# EAGLE design RM1xx-Breakout (EAGLE 7.7.0)
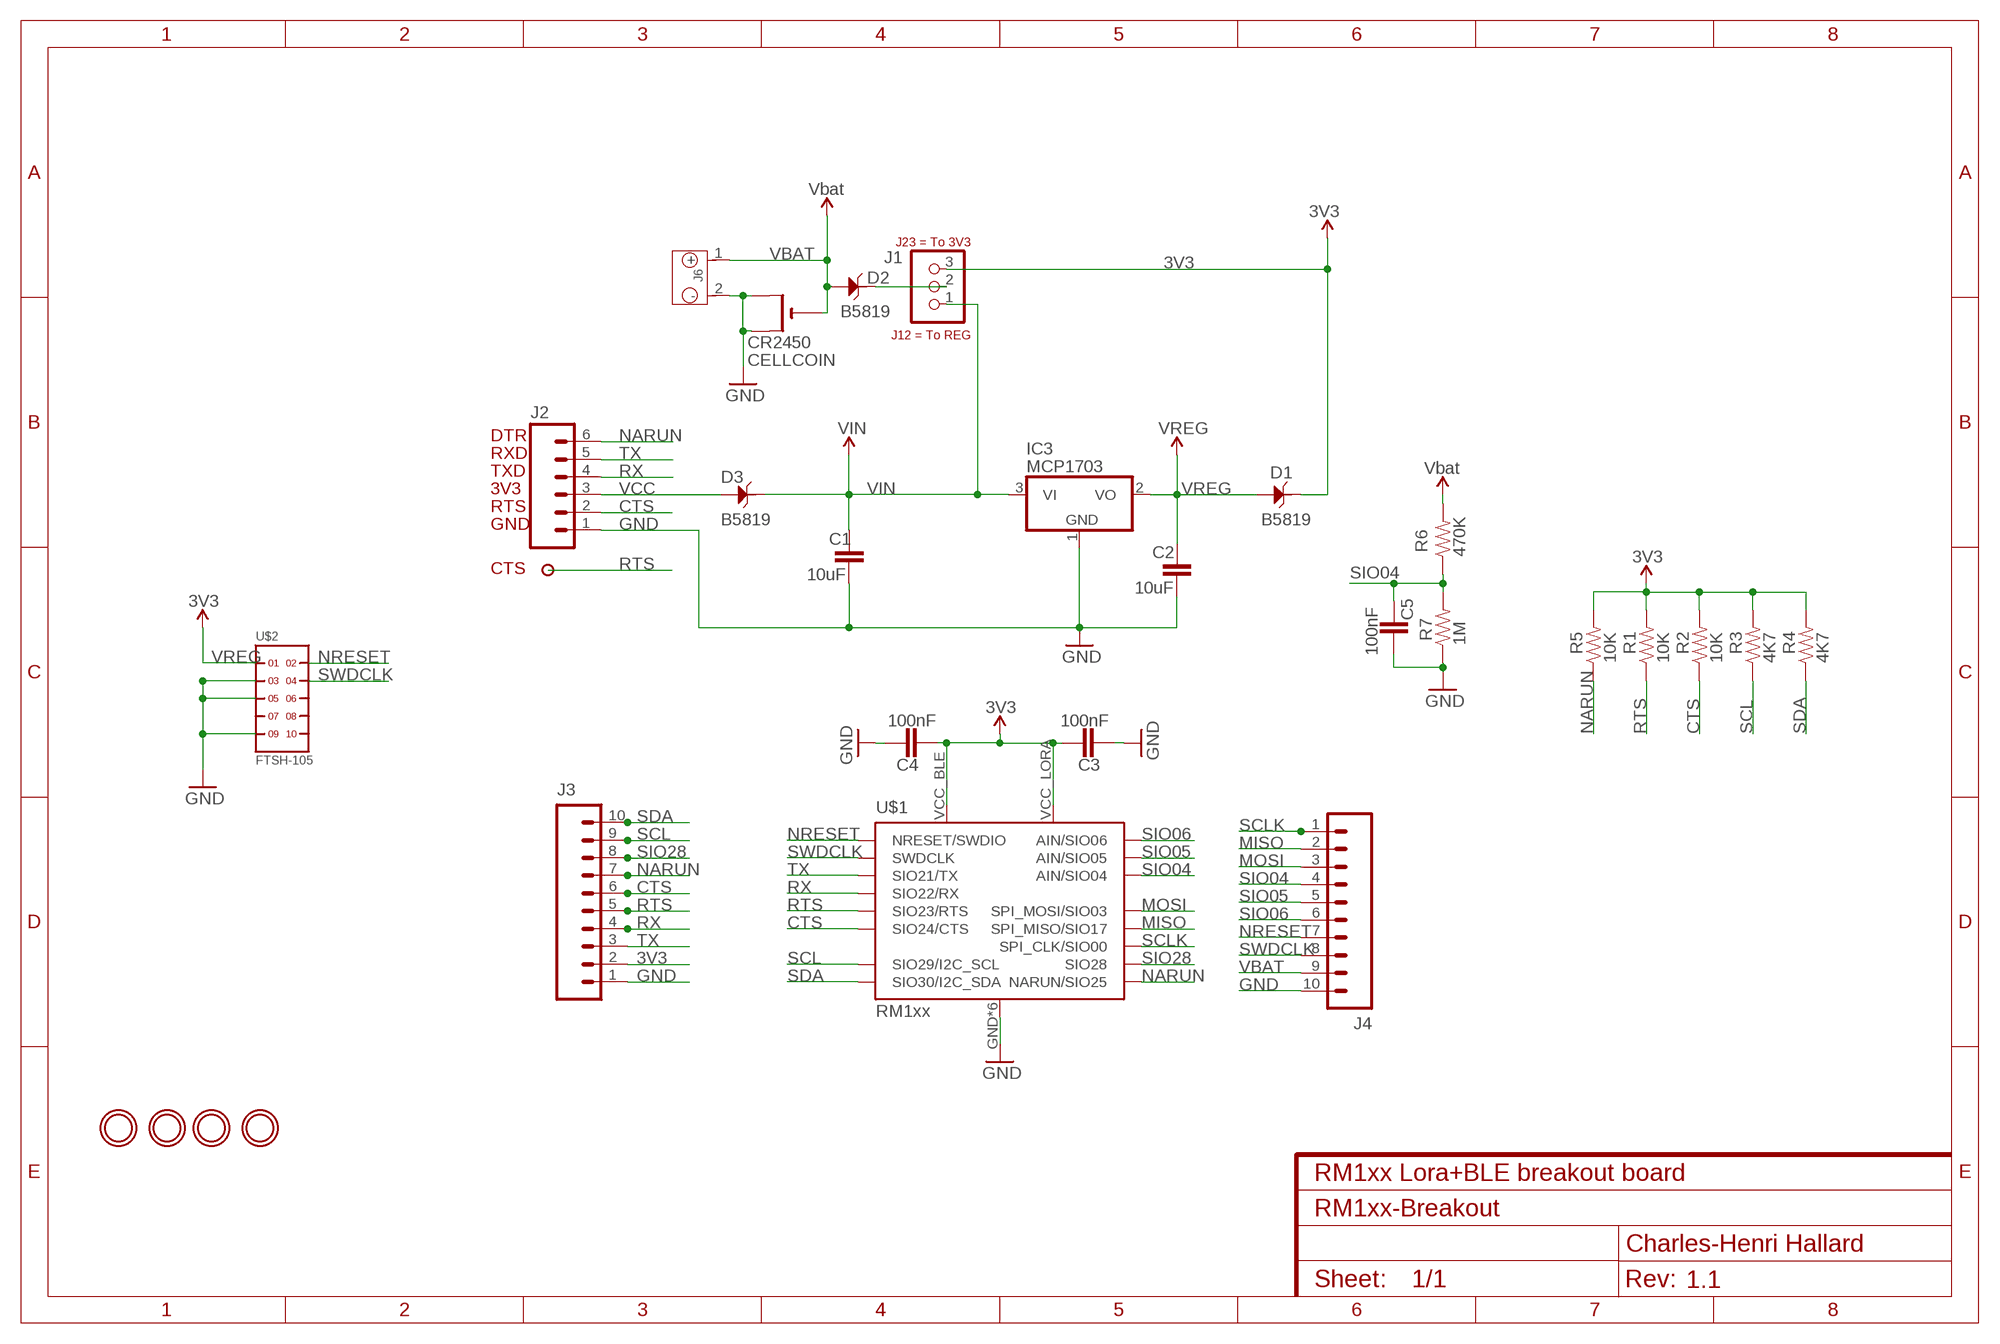
[diagram p0: schematic, sheet 1]
NAME (FRAME-A4L): CNAME: RM1xx Lora+BLE breakout board; CREVISION: 1.1; DESIGNER: Charles-Henri Hallard

## Parts
C1  10uF  CAP0805-CAP  [0805-CAP]
C2  10uF  CAP0805-CAP  [0805-CAP]
C3  100nF  CAP0805-CAP  [0805-CAP]
C4  100nF  CAP0805-CAP  [0805-CAP]
C5  100nF  CAP0805-CAP  [0805-CAP]
CELLCOIN  CR2450  CR2450SMD  [CR2450-SMD]
D1  B5819  D-ESD-2P-CESD5V0D1  [SOD123-2.7X1.6]
D2  B5819  D-ESD-2P-CESD5V0D1  [SOD123-2.7X1.6]
D3  B5819  D-ESD-2P-CESD5V0D1  [SOD123-2.7X1.6]
IC3  MCP1703  MCP1703CB  [SOT23]
J1  JUMPER_1X30805  [JP3_0805]
J2  M06SIP_LOCK  [1X06-SIP_LOCK]
J3  M10LOCK  [1X10_LOCK]
J4  M10LOCK  [1X10_LOCK]
J6  Lipo Battery  JST-2P-PW-3410070P1  [2P-2.0-90D]
P1  PADNORMAL  [PAD]
R1  10K  RESISTOR0805-RES  [0805-RES]
R2  10K  RESISTOR0805-RES  [0805-RES]
R3  4K7  RESISTOR0805-RES  [0805-RES]
R4  4K7  RESISTOR0805-RES  [0805-RES]
R5  10K  RESISTOR0805-RES  [0805-RES]
R6  470K  RESISTOR0805-RES  [0805-RES]
R7  1M  RESISTOR0805-RES  [0805-RES]
U$1  RM1xx  RM1XXSMD  [RM1XX]
U$2  FTSH-105  FTSH-105-01-XXX-DV-K  [FTSH-105-01-XXX-DV-K]
U$3  MOUNTINGHOLE2.5  [MOUNTINGHOLE_2.5_PLATED]
U$6  MOUNTINGHOLE2.5  [MOUNTINGHOLE_2.5_PLATED]
U$7  MOUNTINGHOLE2.5  [MOUNTINGHOLE_2.5_PLATED]
U$8  MOUNTINGHOLE2.5  [MOUNTINGHOLE_2.5_PLATED]

## Nets
3V3: C3.1 C4.2 D1.2 J1.3 J3.2 R1.2 R2.2 R3.2 R4.2 R5.2 U$1.VCC_BLE U$1.VCC_LORA
CTS: J2.2 J3.6 R2.1 U$1.SIO24(SIO24/CTS)
GND: C1.2 C2.2 C3.2 C4.1 C5.1 CELLCOIN.+$1(+) CELLCOIN.+$2(+1) IC3.1(GND) J2.1 J3.1 J4.10 J6.2(-) R7.1 U$1.GND U$1.GND1(GND) U$1.GND2(GND) U$1.GND3(GND) U$1.GND4(GND) U$1.GND5(GND) U$2.3 U$2.5 U$2.9
MISO: J4.2 U$1.SIO17(SPI_MISO/SIO17)
MOSI: J4.3 U$1.SIO03(SPI_MOSI/SIO03)
N$3: D2.2 J1.2
NARUN: J2.6 J3.7 R5.1 U$1.SIO25(NARUN/SIO25)
NRESET: J4.7 U$1.RESET(NRESET/SWDIO) U$2.2
RTS: J3.5 P1.1 R1.1 U$1.SIO23(SIO23/RTS)
RX: J2.4 J3.4 U$1.SIO22(SIO22/RX)
SCL: J3.9 R3.1 U$1.SIO29(SIO29/I2C_SCL)
SCLK: J4.1 U$1.SIO00(SPI_CLK/SIO00)
SDA: J3.10 R4.1 U$1.SIO30(SIO30/I2C_SDA)
SIO04: C5.2 J4.4 R6.1 R7.2 U$1.SIO04(AIN/SIO04)
SIO05: J4.5 U$1.SIO05(AIN/SIO05)
SIO06: J4.6 U$1.SIO06(AIN/SIO06)
SIO28: J3.8 U$1.SIO28
SWDCLK: J4.8 U$1.SWDCLK U$2.4
TX: J2.5 J3.3 U$1.SIO21(SIO21/TX)
VBAT: CELLCOIN.- D2.1 J4.9 J6.1(+) R6.2 ; supply symbol labelled Vbat
VCC: D3.1 J2.3
VIN: C1.1 D3.2 IC3.3(VI) J1.1
VREG: C2.1 D1.1 IC3.2(VO) U$2.1 ; supply symbol labelled 3V3
Unconnected: U$2.6 U$2.7 U$2.8 U$2.10

## Notes on the sheet
- DTR
- RXD
- TXD
- 3V3
- RTS
- GND
- CTS

## Library data of the parts
C1-C5 = LowPowerLab:CAP: Capacitor Standard 0603 ceramic capacitor, and 0.1" leaded capacitor.
CELLCOIN = _c2h:CR2450
D1-D3 = Seeed-Discrete:D-ESD-2P: Diodes for Protectiong against ESD
IC3 = linear:MCP1703: 250 mA, 16V, Low Quiescent Current LDO Regulator Source: http://ww1.microchip.com/downloads/en/DeviceDoc/22049b.pdf
J1 = dp_devices:JUMPER_1X3; J12: To REG; J23: To 3V3
J2 = SparkFun-Connectors:M06: Header 6 Standard 6-pin 0.1" header. Use with straight break away headers (SKU : PRT-00116), right angle break away headers (PRT-00553), swiss pins (PRT-00743), machine pins (PRT-00117), and female headers (PRT-00115). Molex polarized connector foot print use with SKU : PRT-08094 with associated crimp pins and housings. NOTES ON THE VARIANTS LOCK and LOCK_LONGPADS... This footprint was designed to help hold the alignment of a through-hole component (i.e. 6-pin header) while soldering it into place. You may notice that each hole has been shifted either up or down by 0.005 of an inch from it's more standard position (which is a perfectly straight line). This slight alteration caused the pins (the squares in the middle) to touch the edges of the holes. Because they are alternating, it causes a "brace" to hold the component in place. 0.005 has proven to be the perfect amount of "off-center" position when using our standard breakaway headers. Although looks a little odd when you look at the bare footprint, once you have a header in there, the alteration is very hard to notice. Also,if you push a header all the way into place, it is covered up entirely on the bottom side. This idea of altering the position of holes to aid alignment will be further integrated into the Sparkfun Library for other footprints. It can help hold any component with 3 or more connection pins.
J3 J4 = SparkFun-Connectors:M10: Header 10 Standard 10-pin 0.1" header. Use with straight break away headers (SKU : PRT-00116), right angle break away headers (PRT-00553), swiss pins (PRT-00743), machine pins (PRT-00117), and female headers (PRT-00115).
J6 = Seeed-Connector:JST-2P-PW
P1 = _c2h:PAD
R1-R7 = _c2h:RESISTOR: Resistor Basic schematic elements and footprints for 0603, 1206, and PTH resistors.
U$1 = _c2h:RM1XX
U$2 = samtec:FTSH-105-01-XXX-DV-K
U$3 U$6-U$8 = microbuilder:MOUNTINGHOLE: Mounting Hole For #2 screws (0.086"/2.18mm width, 0.094"/2.4mm hole) use 2.5mm

## Net classes
1 power: width 0.381 mm, clearance 0.254 mm

## Board
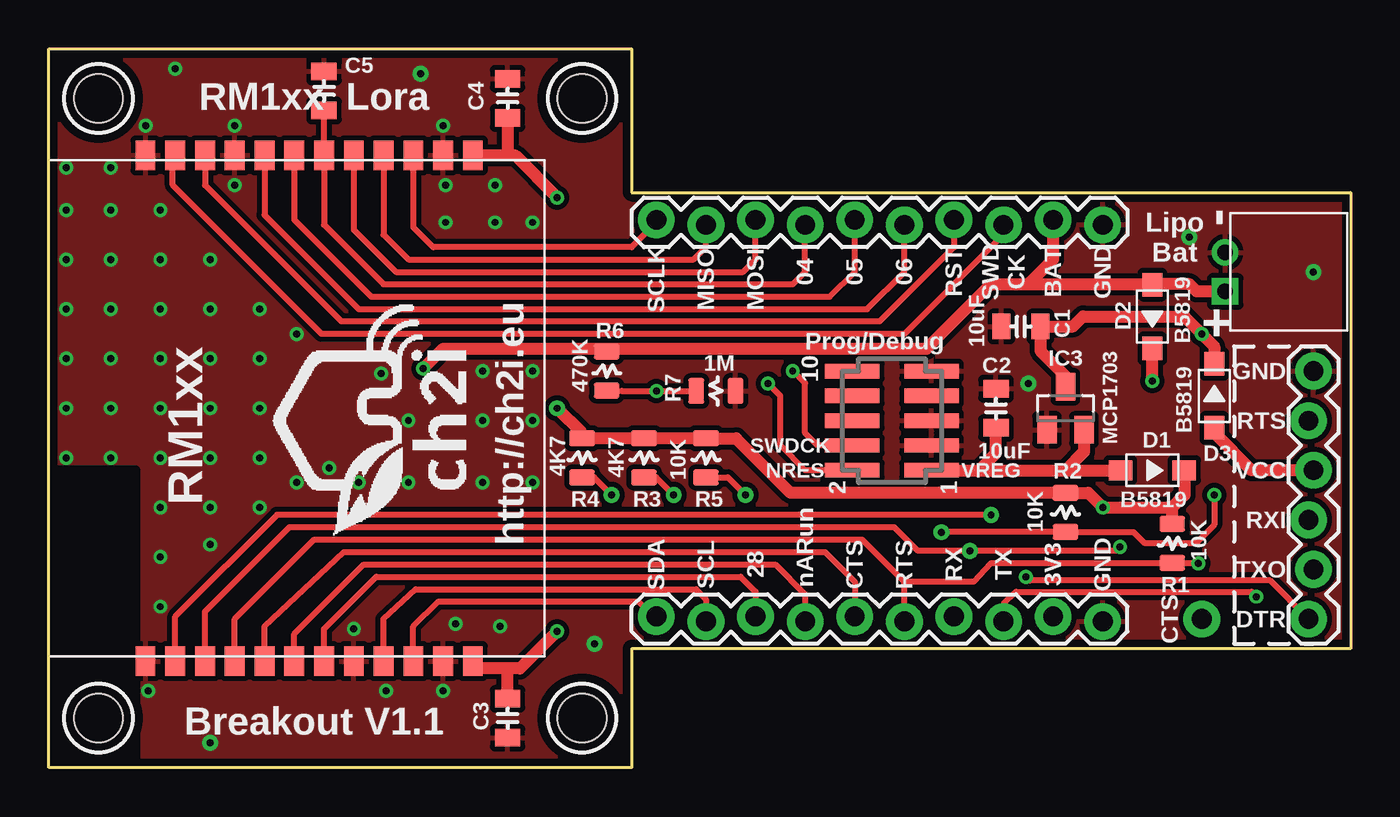
[diagram p1: board, top side]
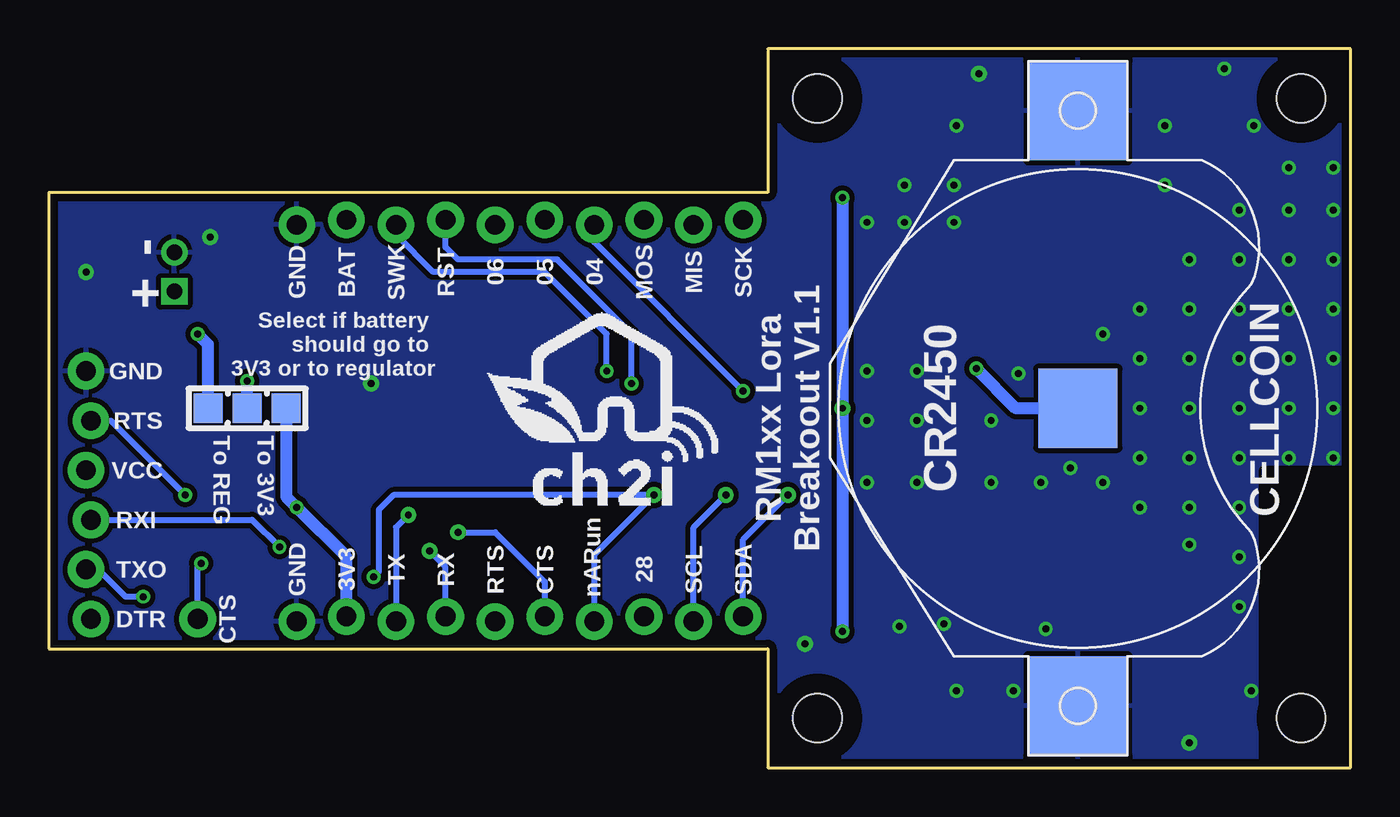
[diagram p2: board, bottom side, seen from below]

Size 66.67 x 36.83 mm. Coordinates in mm from the lower left corner, seen from the top.
Outline: 0,36.83 29.84,36.83 29.84,29.46 66.67,29.46 66.67,6.1 29.84,6.1 29.84,0 0,0 0,36.83
Copper layers (1*16): Top 0.0356mm / dielectric 1.5011mm / Bottom 0.0356mm
Design rules "PCBs_io *": minimum track width 6mil, minimum drill 13mil, track to track 6mil, track to pad 6mil, pad to pad 6mil, via to via 6mil, smd to smd 6mil, copper to edge 15mil, drill to drill 6mil, minimum pad ring 7mil, minimum via ring 7mil, stop-mask expansion 3mil, vias tented up to drill 40mil, thermal gap 10mil
tRestrict: area 0,0 to 4.4,15.2
bRestrict: area 0,0 to 4.4,15.2

### Footprints (pad centres in the part's own frame; a part is rotated, then mirrored left to right if it is on the bottom)
0805-CAP = smd 0.902 x 1.3: 1 -1,0; 2 1,0
CR2450-SMD = smd 5.08 x 5.08: +$1 -15.24,0; +$2 15.24,0 | smd 4.064 x 4.064: - 0,0
SOD123-2.7X1.6 = smd 1.2 x 1.02: 1 -1.635,0; 2 1.635,0
SOT23 = smd 1 x 1.4: 1 -0.95,-1.1; 2 0.95,-1.1; 3 0,1.1
JP3_0805 = smd 1.5 x 1.5: 1 -2,0; 2 0,0; 3 2,0
1X06-SIP_LOCK = drill 1.016 pad 1.88: 1 0,0; 2 2.54,-0.254; 3 5.08,0; 4 7.62,-0.254; 5 10.16,0; 6 12.7,-0.254
1X10_LOCK = drill 1.016 pad 1.88: 1 0,0.127; 2 2.54,-0.127; 3 5.08,0.127; 4 7.62,-0.127; 5 10.16,0.127; 6 12.7,-0.127; 7 15.24,0.127; 8 17.78,-0.127; 9 20.32,0.127; 10 22.86,-0.127
2P-2.0-90D = drill 0.8 pad 1.35 square: 1 -1,3.25 | drill 0.8 pad 1.35: 2 1,3.25
PAD = drill 1.016 pad 1.88: 1 0,0
0805-RES = smd 0.8 x 1.3: 1 -1,0; 2 1,0
RM1XX = smd 1.524 x 1.016: GND -12.319,8.382; GND1 13.589,8.382; GND2 -12.319,-2.286; GND3 -12.319,-6.858; GND4 13.589,-6.858; GND5 13.589,3.81; RESET 13.589,5.334; SIO00 13.589,-5.334; SIO03 13.589,-2.286; SIO04 13.589,-0.762; SIO05 13.589,0.762; SIO06 13.589,2.286; SIO17 13.589,-3.81; SIO21 -12.319,6.858; SIO22 -12.319,5.334; SIO23 -12.319,3.81; SIO24 -12.319,2.286; SIO25 -12.319,0.762; SIO28 -12.319,-0.762; SIO29 -12.319,-3.81; SIO30 -12.319,-5.334; SWDCLK 13.589,6.858; VCC_BLE -12.319,-8.382; VCC_LORA 13.589,-8.382
FTSH-105-01-XXX-DV-K = smd 0.737 x 2.794: 1 -2.54,-2.032; 2 -2.54,2.032; 3 -1.27,-2.032; 4 -1.27,2.032; 5 0,-2.032; 6 0,2.032; 7 1.27,-2.032; 8 1.27,2.032; 9 2.54,-2.032; 10 2.54,2.032
MOUNTINGHOLE_2.5_PLATED = hole 2.5: 0,0

### Placement (x,y rotation side)
C1  49.78,22.61 180 top
C2  48.51,18.41 90 top
C3  23.49,2.54 270 top
C4  23.49,34.29 270 top
C5  14.1,34.67 270 top
CELLCOIN  13.97,18.41 270 bottom
D1  56.52,15.24 0 top
D2  56.52,23.11 270 top
D3  59.69,19.05 90 top
IC3  52.07,18.41 0 top
J1  56.52,18.41 0 bottom
J2  64.77,20.32 270 top
J3  53.97,7.62 180 top
J4  31.11,27.94 0 top
J6  63.5,25.4 90 top
P1  59.05,7.62 0 top
R1  57.53,11.49 90 top
R2  52.07,13.08 90 top
R3  30.48,15.87 90 top
R4  27.3,15.87 90 top
R5  33.66,15.87 90 top
R6  28.57,20.32 90 top
R7  34.16,19.3 180 top
U$1  13.33,17.78 90 top
U$2  43.18,17.78 90 top
U$3  27.3,34.29 0 top
U$4  [LOGO_CH2I_110MM]  18.41,18.41 90 top
U$5  [LOGO_CH2I_110MM]  37.72,16.38 0 bottom
U$6  27.3,2.54 0 top
U$7  2.54,34.29 0 top
U$8  2.54,2.54 0 top

### Tracks (layer width: path | path; a pad name or v marks a point on that pad's centre or on a via)
3V3  (via drill 0.36 pad 0.71, 0.36 pad 0.81)
  Top 0.305: 58.17,15.22 D1.2
  Top 0.61: U$1.VCC_LORA 23.49,31.37 | 23.49,31.37 23.88,31.37 v26.03,29.21 | v26.03,6.98 24.13,5.08 23.49,5.08 | 23.49,5.08 22.1,5.08 U$1.VCC_BLE | 58.17,15.22 58.17,13.97 57.53,13.33 | 57.53,13.33 v53.97,13.33 53.23,14.08 R2.2 37.99,14.08 35.2,16.88 R5.2 R3.2 R4.2 27.3,17.15 v26.03,18.41 | R1.2 57.53,13.33 | C4.2 23.49,31.37 | C3.1 23.49,5.08
  Bottom 0.61: v26.03,29.21 v26.03,18.41 v26.03,6.98 | J1.3 54.52,13.87 v53.97,13.33 51.43,10.79 J3.2
CTS  (via drill 0.36 pad 0.71, 0.36 pad 0.81)
  Top 0.305: U$1.SIO24 11.05,7.24 15.11,11.05 39.75,11.05 41.27,9.53 J3.6 | v59.69,13.97 59.69,12.45 58.74,11.49 56.13,11.49 55.56,12.06 52.09,12.06 R2.1 45.74,12.08 v45.72,12.06
  Bottom 0.305: J2.2 63.5,17.78 v59.69,13.97 | v45.72,12.06 43.81,12.06 41.27,9.53 J3.6
GND  (via drill 0.36 pad 0.71, 0.36 pad 0.81)
  other vias: 58.42,27.18 64.77,25.4 50.16,19.69 19.05,35.56 27.94,6.35 8.26,1.27 6.48,35.81 5.72,28.58 5.72,26.03 5.72,23.49 5.72,20.95 5.72,18.41 5.72,15.87 5.72,13.33 5.72,10.79 5.72,8.26 4.95,32.89 9.53,32.89 20.19,32.89 5.08,3.94 17.27,3.94 20.19,3.94 8.26,26.03 8.26,23.49 8.26,20.95 8.26,18.41 8.26,15.87 8.26,13.33 10.79,23.49 10.79,20.95 10.79,15.87 10.79,13.33 10.79,18.41 12.7,14.6 12.7,22.23 18.41,14.6 22.23,14.6 22.23,20.32 18.41,17.78 15.62,7.11 20.83,7.37 23.11,7.24 8.26,11.43 20.32,27.94 20.32,29.84 22.86,27.94 22.86,29.84 24.77,27.94 9.53,29.84 3.18,28.58 3.18,26.03 3.18,23.49 3.18,20.95 3.18,18.41 3.18,15.87 0.89,15.87 0.89,18.41 0.89,20.95 0.89,23.49 0.89,26.03 0.89,28.58 0.89,30.73 3.18,30.73 15.88,14.6 22.23,17.78 24.77,14.6 24.77,17.78 24.77,20.32 17.02,20.19 14.35,15.37
  pour Top (isolate 0.254, rank 6): -1.27,37.72 -1.27,-0.89 67.31,-0.89 67.31,37.72
  pour Bottom (isolate 0.254): -1.9,38.35 -1.9,-1.52 68.58,-1.52 68.58,38.35
MISO
  Top 0.305: U$1.SIO17 17.15,27.3 18.41,26.03 33.02,26.03 33.66,26.67 J4.2
MOSI
  Top 0.305: U$1.SIO03 15.62,27.56 17.78,25.4 35.56,25.4 36.2,26.03 J4.3
N$3  (via drill 0.36 pad 0.71)
  Top 0.61: v56.52,19.81 D2.2
  Bottom 0.61: J1.2 v56.52,19.81
NARUN  (via drill 0.36 pad 0.71, 0.36 pad 0.81)
  Top 0.305: U$1.SIO25 12.57,6.86 16.13,10.41 37.21,10.41 38.73,8.89 J3.7 | R5.1 34.78,14.87 v35.69,13.97 | v50.04,9.78 50.23,9.59 62.55,9.59 J2.6
  Bottom 0.305: J3.7 38.73,10.92 v35.69,13.97 49.02,13.97 49.78,13.21 49.78,10.03 v50.04,9.78
NRESET  (via drill 0.36 pad 0.71)
  Top 0.305: U$1.RESET 8,29.84 14.99,22.86 42.55,22.86 46.35,26.67 J4.7 | U$2.2 38.73,15.24 37.46,16.51 37.46,19.05 v36.83,19.69
  Bottom 0.305: J4.7 46.35,26.67 45.72,26.03 40.64,26.03 36.83,22.23 v36.83,19.69
RTS  (via drill 0.36 pad 0.71)
  Top 0.305: U$1.SIO23 9.53,7.62 13.59,11.68 41.66,11.68 43.81,9.53 | 57.39,10.29 R1.1 | J3.5 43.81,9.53 | 43.81,9.53 47.37,9.53 48.26,10.48 57.52,10.48 R1.1 | v58.86,10.48 57.55,10.48 R1.1
  Bottom 0.305: P1.1 59.05,10.29 v58.86,10.48
RX  (via drill 0.36 pad 0.71, 0.36 pad 0.81)
  Top 0.305: U$1.SIO22 8,8 12.32,12.32 43.31,12.32 44.51,11.11 v47.18,11.11 54.67,11.11 v54.86,11.3
  Bottom 0.305: J3.4 46.35,10.29 v47.18,11.11 | v54.86,11.3 56.26,12.7 J2.4
SCL  (via drill 0.36 pad 0.81)
  Top 0.305: U$1.SIO29 17.15,7.62 18.8,9.14 33.15,9.14 33.66,8.64 J3.9 | R3.1 31.1,14.87 v32,13.97
  Bottom 0.305: 33.66,8.26 J3.9 33.66,12.32 v32,13.97
SCLK
  Top 0.305: J4.1 30.99,27.94 30.99,27.81 29.84,26.67 19.69,26.67 18.67,27.69 U$1.SIO00
SDA  (via drill 0.36 pad 0.81)
  Top 0.305: U$1.SIO30 18.67,7.24 19.94,8.51 30.23,8.51 30.99,7.75 30.99,7.62 J3.10 | R4.1 27.92,14.87 v28.83,13.97
  Bottom 0.305: J3.10 31.11,11.68 v28.83,13.97
SIO04  (via drill 0.36 pad 0.71)
  Top 0.305: J4.4 38.73,25.4 38.1,24.77 17.15,24.77 14.1,27.81 U$1.SIO04 C5.2 | R6.1 28.97,19.32 29.34,19.3 v31.11,19.3 R7.2
  Bottom 0.305: J4.4 38.73,26.92 v31.11,19.3
SIO05
  Top 0.305: U$1.SIO05 12.57,28.07 16.51,24.13 40,24.13 41.27,25.4 J4.5
SIO06
  Top 0.305: U$1.SIO06 11.05,28.32 15.88,23.49 41.91,23.49 43.81,25.4 J4.6
SIO28
  Top 0.305: U$1.SIO28 14.1,7.11 16.76,9.78 35.43,9.78 36.2,9.02 J3.8
SWDCLK  (via drill 0.36 pad 0.71)
  Top 0.305: U$1.SWDCLK 6.35,31.24 6.35,29.84 13.97,22.23 43.81,22.23 48.89,27.3 J4.8 | U$2.4 39.37,16.51 38.73,17.15 38.73,19.69 v38.1,20.32
  Bottom 0.305: J4.8 48.89,27.3 46.99,25.4 41.27,25.4 38.1,22.23 v38.1,20.32
TX  (via drill 0.36 pad 0.71, 0.36 pad 0.81)
  Top 0.305: U$1.SIO21 6.48,7.75 11.68,12.95 v48.26,12.95 | J3.3 48.89,8.38 49.53,9.02 61.59,9.02 v61.85,8.76
  Bottom 0.305: v48.26,12.95 48.89,12.32 J3.3 | J2.5 64.14,10.16 62.74,8.76 v61.85,8.76
VBAT  (via drill 0.36 pad 0.71)
  Top 0.305: R6.2 26.18,21.32 26.03,21.46
  Top 0.61: 50.16,24.77 48.26,24.77 44.96,21.46 26.03,21.46 20.19,21.46 v19.18,20.45 | 50.16,24.77 56.5,24.77 D2.1 56.53,24.77 58.42,24.77 58.78,24.4 J6.1 | J4.9 51.43,26.03 50.16,24.77
  Bottom 0.61: CELLCOIN.- 17.15,18.41 v19.18,20.45
VCC
  Top 0.61: J2.3 61.59,15.24 59.69,17.15 D3.1
VIN  (via drill 0.36 pad 0.71)
  Top 0.61: D3.2 59.69,21.59 v59.05,22.23 58.17,23.11 52.96,23.11 52.45,22.61 C1.1 50.78,21.35 52.07,20.07 IC3.3
  Bottom 0.61: J1.1 58.52,21.69 v59.05,22.23
VREG
  Top 0.61: U$2.1 47.62,15.24 | 47.62,15.24 52.07,15.24 | 52.07,15.24 D1.1 | 47.62,15.24 48.51,16.13 C2.1 | IC3.2 53.02,16.19 52.07,15.24

### Text on the board
tPlace: RM1xx Lora | - | Lipo / Bat | SCLK | MISO | MOSI | 04 | 05 | 06 | RST | SWD / CK | BAT | GND | + | Prog/Debug | 10 | GND | http://ch2i.eu | RTS | SWDCK | NRES | VREG | VCC | 2 | 1 | RXI | nARun | SDA | SCL | 28 | CTS | RTS | RX | TX | 3V3 | GND | TXO | CTS | DTR | Breakout V1.1
bPlace: - | SCK | MIS | MOS | 04 | 05 | 06 | RST | SWK | BAT | GND | + | Select if battery / should go to / 3V3 or to regulator | GND | RM1xx Lora / Breakoout V1.1 | RTS | VCC | RXI | nARun | SDA | SCL | 28 | CTS | RTS | RX | TX | 3V3 | GND | TXO | CTS | DTR